# Altium schematic sheet Daughtercard.SchDoc
size A; SheetNumber: 1; SheetTotal: 1
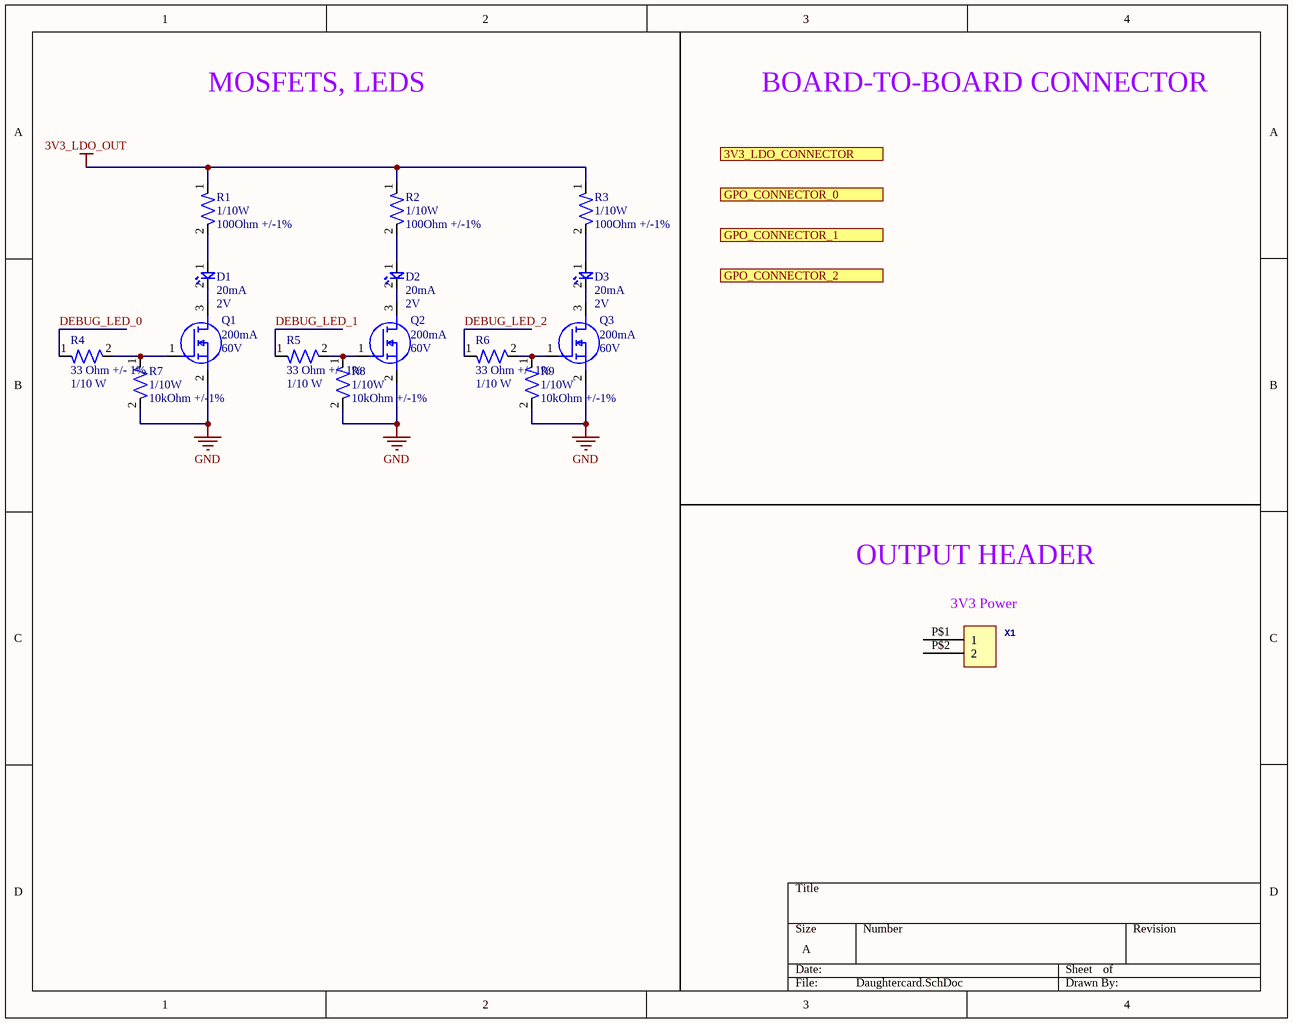
[diagram p0: Daughtercard.SchDoc]

## Parts
D1  Current Rating: 20mA  Vf: 2V  [LED-0603]  (hidden comment: 150060AS75000)
D2  Current Rating: 20mA  Vf: 2V  [LED-0603]  (hidden comment: 150060AS75000)
D3  Current Rating: 20mA  Vf: 2V  [LED-0603]  (hidden comment: 150060AS75000)
Q1  Id-Continuous: 200mA  VDS-Max: 60V  [NMOS-SOT23-3]  (hidden comment: T2N7002AK,LM)
Q2  Id-Continuous: 200mA  VDS-Max: 60V  [NMOS-SOT23-3]  (hidden comment: T2N7002AK,LM)
Q3  Id-Continuous: 200mA  VDS-Max: 60V  [NMOS-SOT23-3]  (hidden comment: T2N7002AK,LM)
R1  Power Rating: 1/10W  Resistance: 100Ohm +/-1%  [RES-0603]  (hidden comment: AC0603FR-10100RL)
R2  Power Rating: 1/10W  Resistance: 100Ohm +/-1%  [RES-0603]  (hidden comment: AC0603FR-10100RL)
R3  Power Rating: 1/10W  Resistance: 100Ohm +/-1%  [RES-0603]  (hidden comment: AC0603FR-10100RL)
R4  Resistance: 33 Ohm +/- 1%  Power: 1/10 W  [RES-0402]  (hidden comment: ERJ2RKF33R0X)
R5  Resistance: 33 Ohm +/- 1%  Power: 1/10 W  [RES-0402]  (hidden comment: ERJ2RKF33R0X)
R6  Resistance: 33 Ohm +/- 1%  Power: 1/10 W  [RES-0402]  (hidden comment: ERJ2RKF33R0X)
R7  Power Rating: 1/10W  Resistance: 10kOhm +/-1%  [RES-0603]  (hidden comment: RC0603FR-0710KP)
R8  Power Rating: 1/10W  Resistance: 10kOhm +/-1%  [RES-0603]  (hidden comment: RC0603FR-0710KP)
R9  Power Rating: 1/10W  Resistance: 10kOhm +/-1%  [RES-0603]  (hidden comment: RC0603FR-0710KP)
X1  Molex 43650-0215  [43650-0215]  (value not drawn)

## Ports
3V3_LDO_CONNECTOR (in, see Motherboard[2B]), GPO_CONNECTOR_0 (in, see Motherboard[2B]), GPO_CONNECTOR_1 (in, see Motherboard[2B]), GPO_CONNECTOR_2 (in, see Motherboard[2B])

## Nets
3V3_LDO_OUT: R1.1 R2.1 R3.1
GND: Q1.2(S) Q2.2(S) Q3.2(S) R7.2 R8.2 R9.2
DEBUG_LED_0: R4.1
DEBUG_LED_1: R5.1
DEBUG_LED_2: R6.1
NetD1_1: D1.1 R1.2
NetD1_2: D1.2 Q1.3(D)
NetD2_1: D2.1 R2.2
NetD2_2: D2.2 Q2.3(D)
NetD3_1: D3.1 R3.2
NetD3_2: D3.2 Q3.3(D)
NetQ1_1: Q1.1(G) R4.2 R7.1
NetQ2_1: Q2.1(G) R5.2 R8.1
NetQ3_1: Q3.1(G) R6.2 R9.1

Not connected (* = marked no-connect by the designer): X1 P$1(1) P$2(2)

## Notes on the sheet
- MOSFETS, LEDS
- BOARD-TO-BOARD CONNECTOR
- OUTPUT HEADER
- (near X1) 3V3 Power

## Library data of the parts
D1-D3 = LED_Amber_0001: CAP CER 0.1UF 100V X7R 0603; Manufacturer: Wurth Electronik; Assembled?: no; Color: Amber; Manufacturer Part Number: 150060AS75000; Package Size: 0603
Q1-Q3 = NMOS-200MA-0001: MOSFET N-CH 60V 200MA SOT23; Manufacturer: Toshiba; FET type: N-Channel; Rds On-Max: 3.9Ohm; Vgs-Max: 20V; Assembled?: no; Manufacturer Part Number: T2N7002AK,LM; Package: SOT-23-3
R1-R3 = RES-100-0002: 100 Ohms ±1% 0.1W, 1/10W Chip Resistor 0603 (1608 Metric) Automotive AEC-Q200 Thick Film; Manufacturer: YAGEO; Assembled?: no; Manufacturer Part Number: AC0603FR-10100RL; Package Size: 0603
R4-R6 = RES-33-0003-JLC: 100mW Thick Film Resistors ±100ppm/℃ ±1% -55℃~+155℃ 33Ω 0402  Chip Resistor - Surface Mount ROHS; assembled?: yes; JLC part number: C278594
R7-R9 = RES-10K-0002: RES SMD 10K OHM 1% 1/10W 0603; Manufacturer: YAGEO; Assembled?: no; Manufacturer Part Number: RC0603FR-0710KP; Package Size: 0603
X1 = Micro-Fit Molex 2 Pin Vertical: GateName_1: G$1; SymbolName_1: HEADER_POS2; DeviceSetName: HEADER_POS2_?; DeviceName: 43650-0215; LibraryName: con-molex-micro-fit-3_0_2; Package: 43650-0215